# EAGLE design LayerOne_2011_bkt_pots (EAGLE 5.11)
OC_NEWARK: unknown
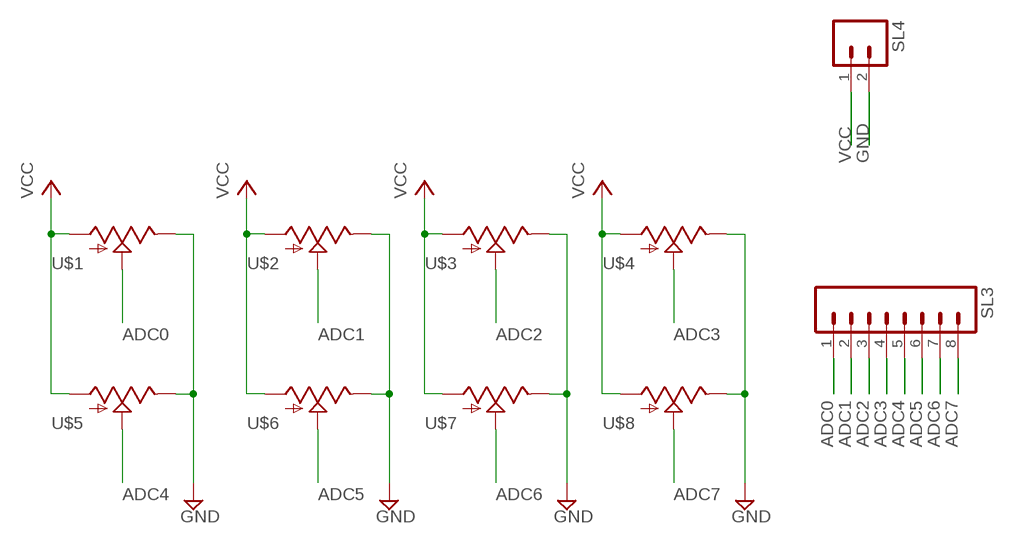
[diagram p0: schematic, sheet 1]

## Parts
SL3  M08  [1X08]
SL4  M02LOCK  [1X02_LOCK]
U$1  LAYERONE_2011_POTPOT_GOLD  [LAYERONE_2011_POT_GOLD]
U$2  LAYERONE_2011_POTPOT_GOLD  [LAYERONE_2011_POT_GOLD]
U$3  LAYERONE_2011_POTPOT_GOLD  [LAYERONE_2011_POT_GOLD]
U$4  LAYERONE_2011_POTPOT_GOLD  [LAYERONE_2011_POT_GOLD]
U$5  LAYERONE_2011_POTPOT_GOLD  [LAYERONE_2011_POT_GOLD]
U$6  LAYERONE_2011_POTPOT_GOLD  [LAYERONE_2011_POT_GOLD]
U$7  LAYERONE_2011_POTPOT_GOLD  [LAYERONE_2011_POT_GOLD]
U$8  LAYERONE_2011_POTPOT_GOLD  [LAYERONE_2011_POT_GOLD]

## Nets
ADC0: SL3.1 U$1.P$2(S)
ADC1: SL3.2 U$2.P$2(S)
ADC2: SL3.3 U$3.P$2(S)
ADC3: SL3.4 U$4.P$2(S)
ADC4: SL3.5 U$5.P$2(S)
ADC5: SL3.6 U$6.P$2(S)
ADC6: SL3.7 U$7.P$2(S)
ADC7: SL3.8 U$8.P$2(S)
GND: SL4.2 U$1.P$3(E) U$2.P$3(E) U$3.P$3(E) U$4.P$3(E) U$5.P$3(E) U$6.P$3(E) U$7.P$3(E) U$8.P$3(E)
VCC: SL4.1 U$1.P$1(A) U$2.P$1(A) U$3.P$1(A) U$4.P$1(A) U$5.P$1(A) U$6.P$1(A) U$7.P$1(A) U$8.P$1(A)

## Library data of the parts
SL3 = SparkFun:M08: Header 8 Standard 8-pin 0.1" header. Use with straight break away headers (SKU : PRT-00116), right angle break away headers (PRT-00553), swiss pins (PRT-00743), machine pins (PRT-00117), and female headers (PRT-00115).
SL4 = SparkFun:M02: Header 2 Standard 2-pin 0.1" header. Use with straight break away headers (SKU : PRT-00116), right angle break away headers (PRT-00553), swiss pins (PRT-00743), machine pins (PRT-00117), and female headers (PRT-00115). Molex polarized connector foot print use with SKU : PRT-08233 with associated crimp pins and housings.
U$1-U$8 = LayerOne_2011:LAYERONE_2011_POT

## Net classes
0 default: width 0.406 mm
1 LED: width 0.305 mm

## Board
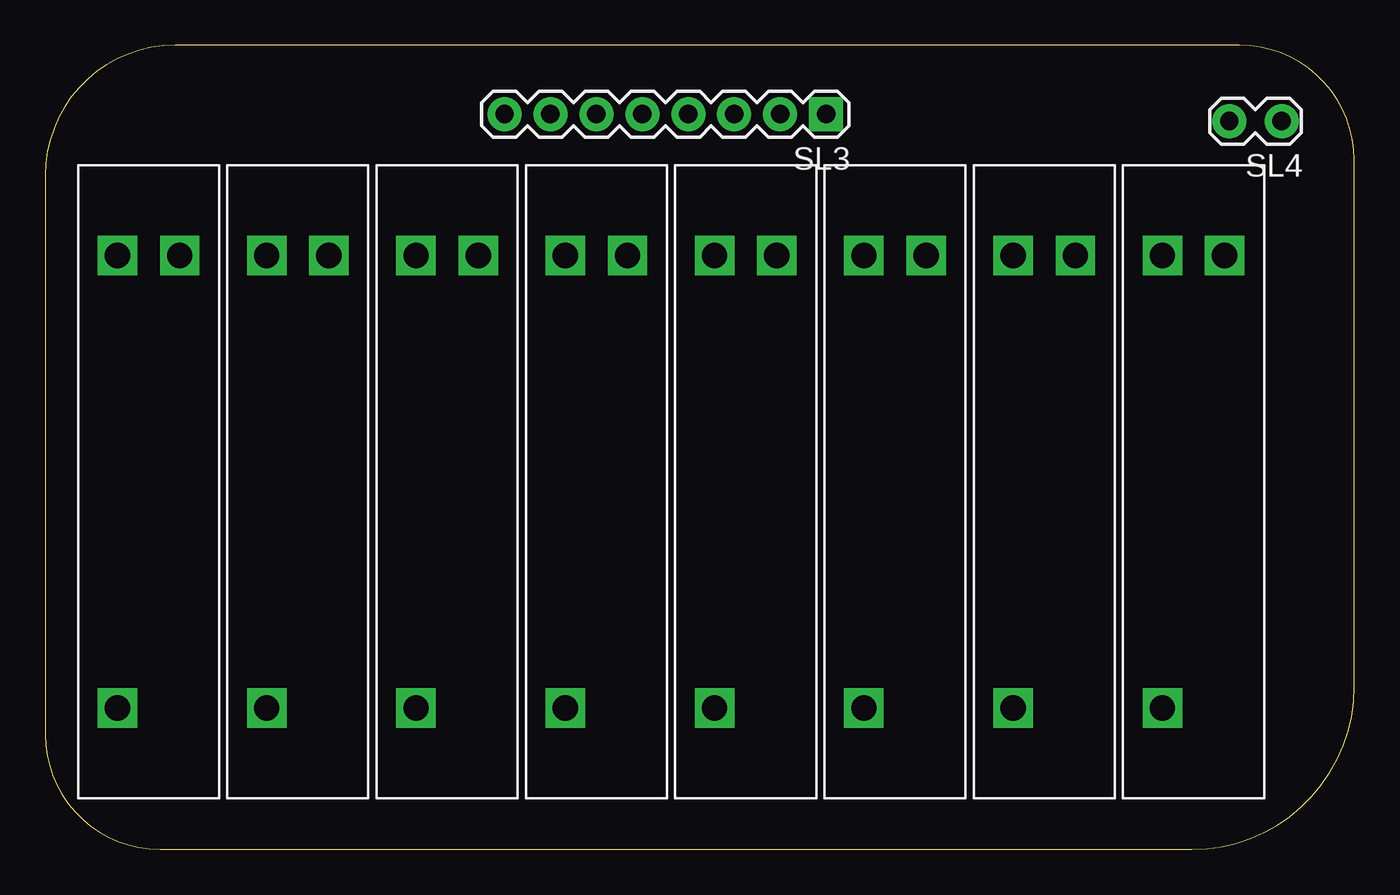
[diagram p1: board, top side]
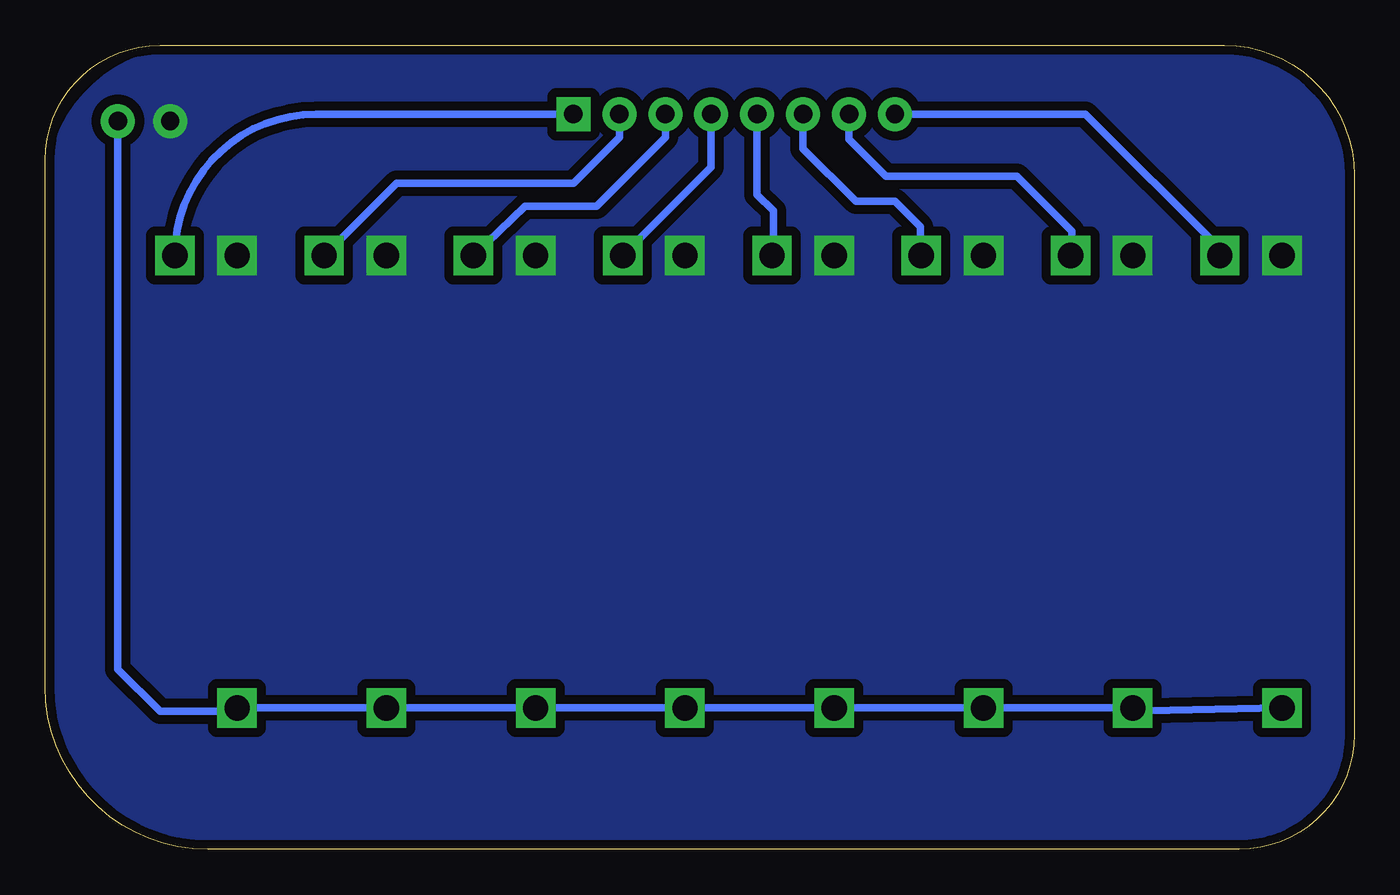
[diagram p2: board, bottom side, seen from below]

Size 72.39 x 44.45 mm. Coordinates in mm from the lower left corner, seen from the top.
Outline: 72.39,38.1 arc90 66.04,44.45 7.18,44.45 arc90 0,37.27 0,6.35 arc90 6.35,0 63.41,0 arc90 72.39,8.98 72.39,38.1
Copper layers (1*16): Top 0.0356mm / dielectric 1.5011mm / Bottom 0.0356mm
Design rules "SparkFun-mod *": minimum track width 8mil, minimum drill 32mil, track to track 14mil, track to pad 14mil, pad to pad 12mil, via to via 12mil, smd to smd 8mil, copper to edge 12mil, drill to drill 8mil, minimum pad ring 14mil, minimum via ring 10mil, stop-mask expansion 4mil, vias tented up to drill 34mil, thermal gap 10mil
Milling: 8 lines

### Footprints (pad centres in the part's own frame; a part is rotated, then mirrored left to right if it is on the bottom)
1X08 = drill 1.016 pad 1.88 square: 1 0,0 | drill 1.016 pad 1.88 round: 2 2.54,0; 3 5.08,0; 4 7.62,0; 5 10.16,0; 6 12.7,0; 7 15.24,0; 8 17.78,0
1X02_LOCK = drill 1.016 pad 1.88 round: 1 -0.178,0; 2 2.718,0
LAYERONE_2011_POT_GOLD = drill 1.397 square: P$1 12.5,-1.72; P$2 -12.5,1.72; P$3 -12.5,-1.72

### Placement (x,y rotation side)
SL3  43.18,40.64 180 top
SL4  68.2,40.26 180 top
U$1  63.5,20.32 270 top
U$2  55.25,20.32 270 top
U$3  46.99,20.32 270 top
U$4  38.73,20.32 270 top
U$5  30.48,20.32 270 top
U$6  22.23,20.32 270 top
U$7  13.97,20.32 270 top
U$8  5.71,20.32 270 top

### Tracks (layer width: path | path; a pad name or v marks a point on that pad's centre or on a via)
ADC0
  Bottom 0.406: SL3.1 57.4,40.64 arc-90 U$1.P$2
ADC1
  Bottom 0.406: U$2.P$2 52.96,36.83 43.18,36.83 40.64,39.37 SL3.2
ADC2
  Bottom 0.406: U$3.P$2 45.84,35.56 41.91,35.56 38.1,39.37 SL3.3
ADC3
  Bottom 0.406: U$4.P$2 35.56,37.72 SL3.4
ADC4
  Bottom 0.406: SL3.5 33.02,36.2 32.13,35.31 32.13,32.89 U$5.P$2
ADC5
  Bottom 0.406: SL3.6 30.48,38.74 27.56,35.81 25.4,35.81 24,34.42 24,32.88 U$6.P$2
ADC6
  Bottom 0.406: SL3.7 27.94,39.24 25.91,37.21 18.67,37.21 15.62,34.16 15.62,32.89 U$7.P$2
ADC7
  Bottom 0.406: U$8.P$2 7.44,33.22 14.86,40.64 SL3.8
GND
  pour Bottom (isolate 0.508, no thermals): 0,0 72.39,0 72.39,36.32 arc90 64.26,44.45 0,44.45
VCC
  Bottom 0.406: U$8.P$1 12.7,7.62 U$7.P$1 U$6.P$1 U$5.P$1 U$4.P$1 U$3.P$1 U$2.P$1 U$1.P$1 61.98,7.62 66.04,7.62 68.38,9.96 SL4.1